# EAGLE schematic temp_sensor (EAGLE 6.4)
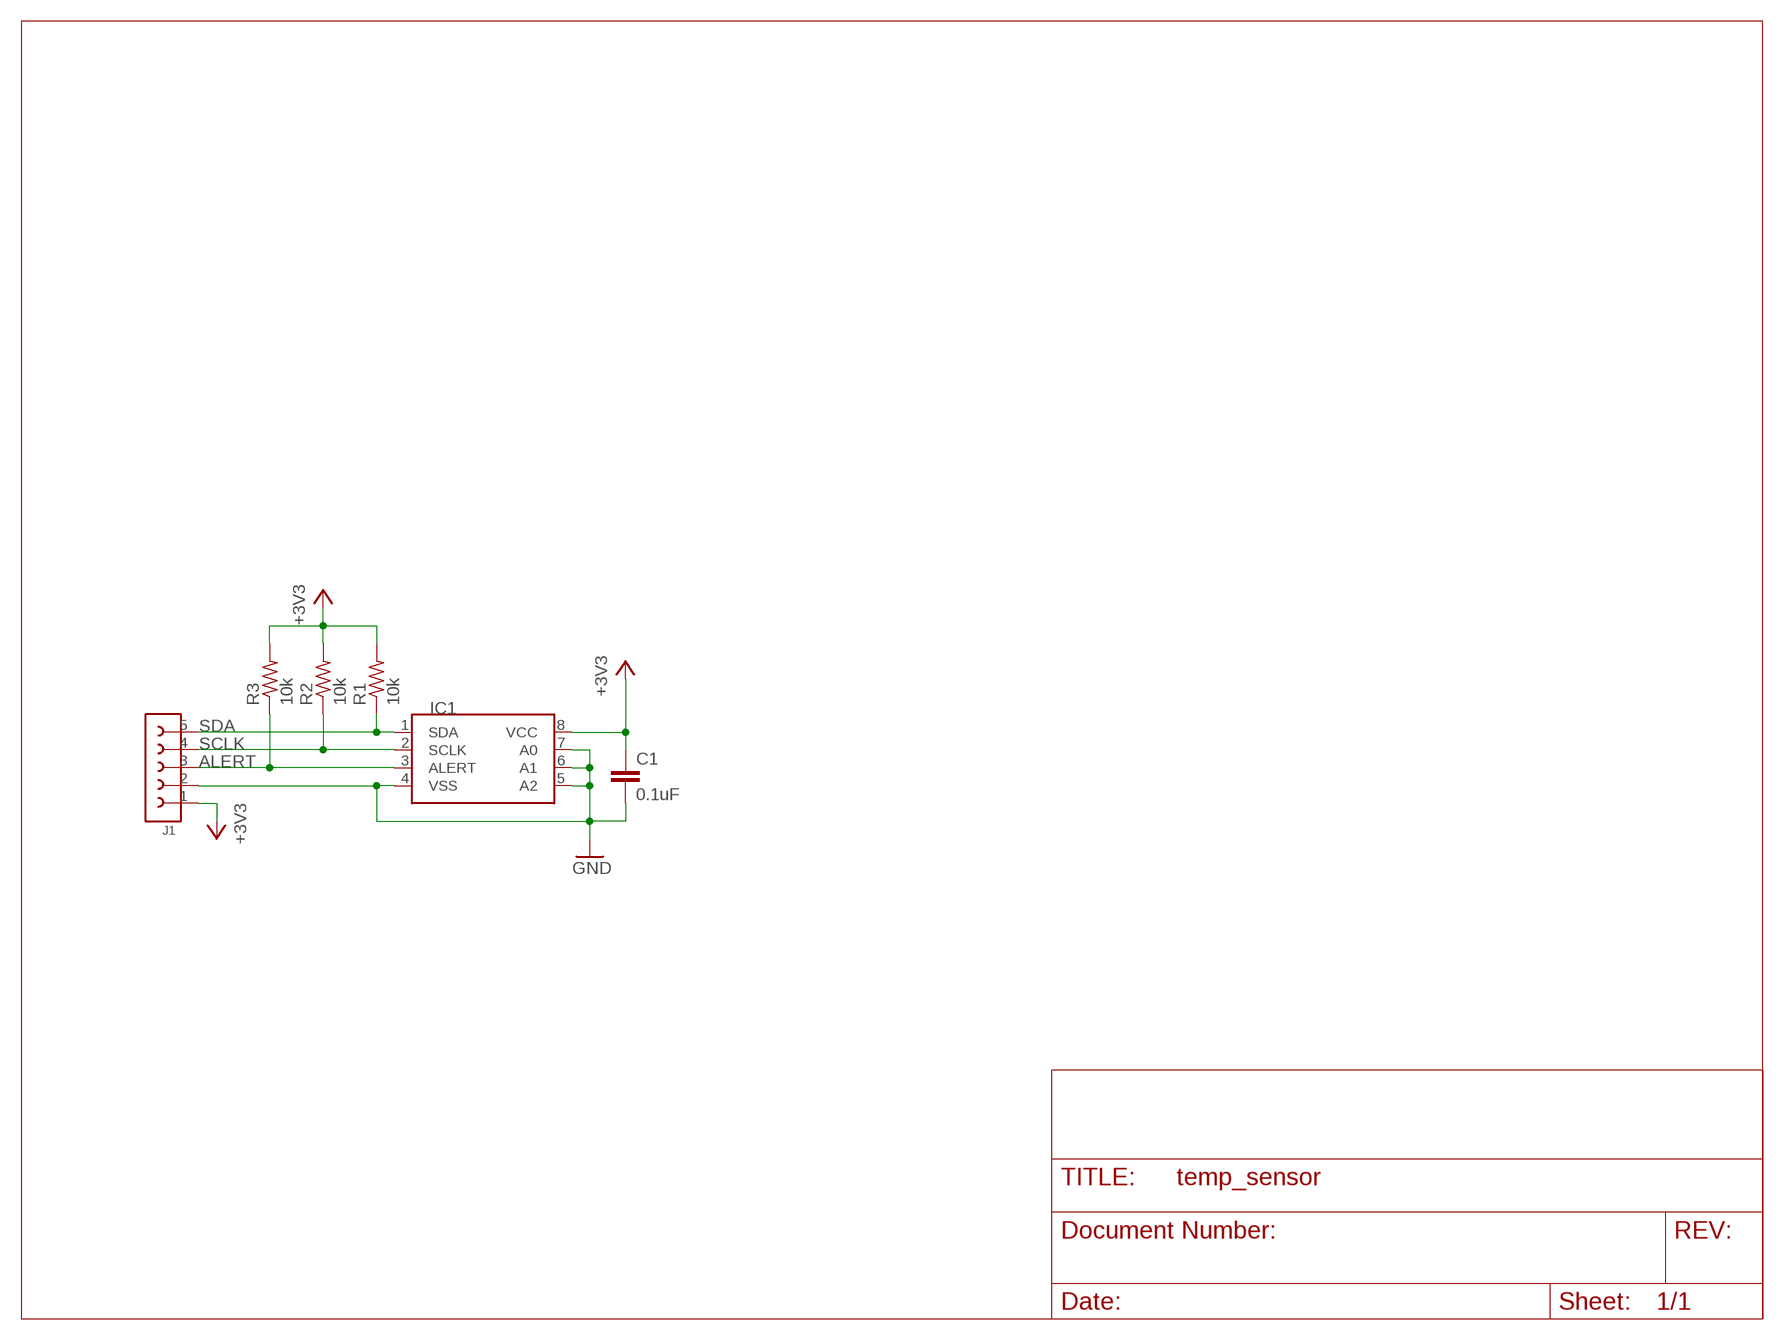
[diagram p0: schematic, sheet 1]

## Parts
C1  0.1uF  C0603C104Z3VAC  [CAPC0603]
IC1  MCP9801-T-M/SN  [SOIC127P600X175-8N]
J1  61300511121  [PHSP254P1270X254X1154-5S]
R1  10k  CRG0603F10K10  [RESC0603]
R2  10k  CRG0603F10K10  [RESC0603]
R3  10k  CRG0603F10K10  [RESC0603]

## Nets
+3V3: C1.1 IC1.8(VCC) J1.1 R1.P$2 R2.P$2 R3.P$2
ALERT: IC1.3(ALERT) J1.3 R3.P$1
GND: C1.2 IC1.4(VSS) IC1.5(A2) IC1.6(A1) IC1.7(A0) J1.2
SCLK: IC1.2(SCLK) J1.4 R2.P$1
SDA: IC1.1(SDA) J1.5 R1.P$1

## Library data of the parts
C1 = kemet-capacitors-ceramic:C?C*VAC: Y5V Dielectric, 6.3 – 50 VDC (Commercial Grade) Description OVERVIEW: KEMET’s Y5V dielectric features an 85°C maximum operating temperature and is considered “general-purpose.” The Electronics Components, Assemblies & Materials Association (EIA) characterizes Z5U dielectric as a Class III material. Components of this classiﬁ cation are ﬁ xed, ceramic dielectric capacitors suited for bypass and decoupling or other applications in which dielectric losses, high insulation resistance and capacitance stability are not of major importance. Y5V exhibits a predictable change in capacitance with respect to time and voltage and displays wide variations in capacitance with reference to ambient temperature. Capacitance change is limited to +22%, -82% from -30°C to +85°C. APPLICATIONS: Typical applications include limited temperature, decoupling and bypass. BENEFITS • -30°C to +85°C operating temperature range • Pb-Free and RoHS Compliant • EIA 0402, 0603, 0805, 1206, and 1210 case sizes • DC voltage ratings of 6.3 V, 10 V, 16 V, 25 V, and 50 V • Capacitance offerings ranging from 0.022 μF to 22 μF • Available capacitance tolerance of +80%/ -20% • Non-polar device, minimizing installation concerns • 100% pure matte tin-plated termination ﬁ nish that allowing for excellent solderability How to Order C 1210 C 226 Z 4 V A C TU Capacitor Class Case Size Specification Series Capacitance Code (pF) Capacitance Tolerance Voltage Dielectric Failure Rate/Design Termination Finish Packaging Grade C = Ceramic 0402 0603 0805 1206 1210 C = Standart 2 signiﬁ cant digits + number of zeros. Use 9 for 1.0 – 9.9 pF Use 8 for 0.5 – .99 pF e.g., 2.2 pF = 229 e.g., 0.5 pF = 508 Z = +80%/-20% 9 = 6.3V 8 = 10V 4 = 16V 3 = 25V 5 = 50 V V = Y5V A = N/A A = 100% Matte Blank = Bulk TU = 7" Reel Unmarked. Ref: Datasheet <http://www.kemet.com/kemet/web/homepage/kechome.nsf/weben/B79D94FAACCDEFCE852579F10063745E/$file/KEM_CC101_COMM_SMD.pdf> Add more variants to C@VAC, just remplace the "@" with a new technologie named according to order code parameters. It is mandatory to fill up the following attributes MANUFACTURER, DESCRIPTION, MOUSER, AVNET, ARROW, FUTURE, NEWARK, DIGIKEY, AVRG-PRICE, OCTOPART-LINK, DATASHEET; DATASHEET: http://www.kemet.com/kemet/web/homepage/kechome.nsf/weben/B79D94FAACCDEFCE852579F10063745E/$file/KEM_CC101_COMM_SMD.pdf; DESCRIPTION: Capacitores cerámicos de capas múltiples (MLCC) - SMD/SMT0603 25volts 0.1uF Y5V -20+80%; EAGLEUP: CAPC0603; M-PRICE: 0.1; MANUFACTURER: KEMET; MOUSER: 80-C0603C104Z3V; OCTOPART-LINK: http://octopart.com/c0603c104z3vactu-kemet-98662
IC1 = mchp-sensors:MCP980*-M/?: 2-Wire High-Accuracy Temperature Sensor Description The MCP9801 is a digital temperature sensor capable of reading temperatures from -55°C to +125°C. Temperature data is measured from an integrated temperature sensor and converted to digital word with a user selectable 9 to 12-bit Sigma Delta Analog to Digital Converter. The MCP9801 notifies the host controller when the ambient temperature exceeds a user programmed set point. The ALERT output is programmable as either a simple comparator for thermostat operation or as a temperature event interrupt. Communication with the sensor is accomplished via a two-wire bus that is compatible with industry standard protocols. This permits reading the current temperature, programming the set point and hysteresis and configuring the device. Address selection inputs allow up to eight MCP9801 sensors to share the same 2-wire bus for multizone monitoring. Small physical size, low installed cost and ease of use make the MCP9801 an ideal choice for implementing sophisticated temperature system management schemes in a variety of applications. FEATURES 2-wire I²C™/SMBus Compatible Interface User Selectable 9- to 12-Bit Resolution ±1°C Accuracy from -10°C to +85°C ±2°C Accuracy from +85°C to +125°C Low Operating Current: 220 µA (typical) Shutdown Mode: 1 µA (max) Power Saving One-Shot Temperature Conversion Measurement Space Saving MSOP and SOIC Packages How to order Device Tape/Reel Temp Range Package MCP9801 MCP9803 Blank T = Tape and Real M -55°C to +125°C OT = SOT-23 MS = MSOP SN = SOIC Ref: Datasheet <http://ww1.microchip.com/downloads/en/DeviceDoc/21909d.pdf>; AVRG-PRICE: 1.17; DATASHEET: http://ww1.microchip.com/downloads/en/DeviceDoc/21909d.pdf; DESCRIPTION: 2 WIRE SERIAL TEMP SENSOR; DIGIKEY: MCP9801-M/SN-ND; MOUSER: 579-MCP9801-M/SN; NEWARK: 88H9948; OCTOPART-LINK: http://octopart.com/mcp9801-m%2Fsn-microchip-515928
J1 = wurth-pin-socket-headers:6130051?: (5) 2.54mm Pin Header Description MATERIAL INSULATOR: PBT FLAMABILITY RATING: UL94-V0 COLOR: BLACK CONTACT MATERIAL: COPPER ALLOY CONTACT TYPE: STAMPED CONTACT PLATING: GOLD QUALITY CLASS: 3 AS PER CECC 75 301-802 PITCH: 2.54MM ENVIRONMENTAL OPERATING TEMPERATURE: -40 UP TO 125°C COMPLIANCE: LEAD FREE AND ROHS ELECTRICAL CURRENT RATING: 3A WORKING VOLTAGE: 250V AC INSULATOR RESISTANCE: >1000 MOHM DIELECTRIC WITHSTANDING VOLTAGE: 500V AC/MN CONTACT RESISTANCE: 20 mOHM MAX DIMENSION B = 2.54 x NB POSITIONS How to order Type Header/Socket Number of Positions Variation 613 = 2.54mm Pitch from 1 to 40 1121 = Pin Header Straigh Post 1021 = Pin Header Right Angle 1821 = Socket Header Straigh Post 43121 = Socket Header Right Angle Ref: Datasheet <http://katalog.we-online.de/em/datasheet/6130xx11121.pdf> , Datasheet <http://katalog.we-online.de/em/datasheet/6130xx11021.pdf> , Datasheet <http://katalog.we-online.de/em/datasheet/6130xx11821.pdf> , Datasheet <http://katalog.we-online.de/em/datasheet/6130xx143121.pdf>
R1-R3 = te-fixed-resistors:CRG?*: Thick Film Chip Resistors 1% and 5% tolerance Description Precious metal terminations are screen printed onto a ceramic base and fired. The resistive element is screen printed and fired and the passivation layer added. Each resistor is trimmed to tolerance by laser. The pre-scribed tile is broken into strips, the end plating is fired on and the strips broken into individual components. Final termination is made by electroplating. Key Features Thick film resistors with a high power to size ratio,ideally suited to industrial and general purpose use. A range from 1 ohm to 10M and tolerances of 1% and 5%. Also including zero ohm links. Suitable for most applications, including high frequency operation, owing to the short lead structure and low capacitance. Seven Package Sizes Terminal finish: Matte Sn MSL Level 2 How to order Common Part Size Tolerance Resistance Value CRG - Thick Film Chip Resistor 0201 0402 0603 0805 1206 2512 F - ±1% J - ±5% 1 ohm (1 ohm) 1R0 1K ohm (1000 ohms) 1K 100K ohm (100000 ohms) 100K 1M ohm (1000000 ohms) 1M Ref: Datasheet <http://www.te.com/commerce/DocumentDelivery/DDEController?Action=showdoc&DocId=Data+Sheet%7F1773204%7FH%7Fpdf%7FEnglish%7FENG_DS_1773204_H.pdf%7F1623095-1>; AVRG-PRICE: 0.1; DATASHEET: http://www.te.com/commerce/DocumentDelivery/DDEController?Action=showdoc&DocId=Data+Sheet%7F1773204%7FH%7Fpdf%7FEnglish%7FENG_DS_1773204_H.pdf%7F1623095-1; DESCRIPTION: Resistores de película gruesa - SMD CRG0603 1% 10K 10KRL; EAGLEUP: RESC0603; MOUSER: 279-CRG0603F10K/10; OCTOPART-LINK: http://octopart.com/crg0603f10k10-tyco+electronics-16077289